# Altium schematic sheet Sheet3_Power.SchDoc
size A; SheetNumber: 3; SheetTotal: 6
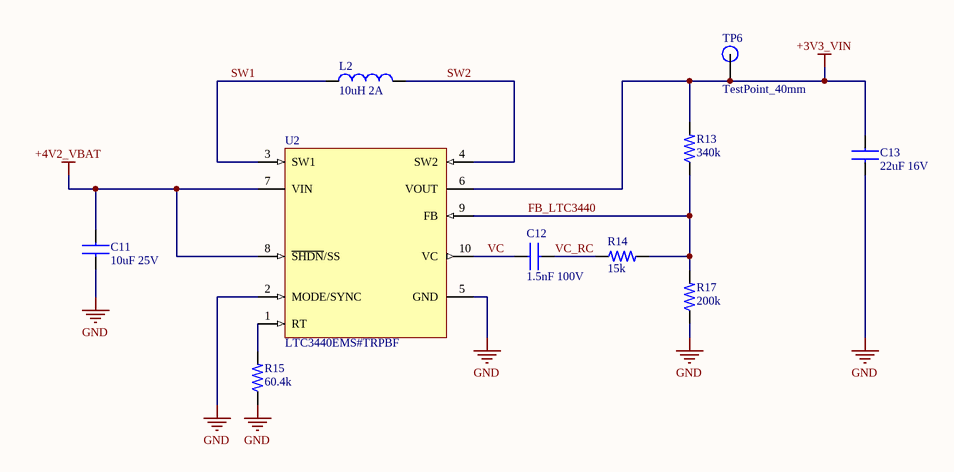
[diagram p0: Sheet3_Power.SchDoc]

## Parts
C11  10uF 25V  [CAP_0805_1_4MM]
C12  1.5nF 100V  [CAP_0805_1_4MM]
C13  22uF 16V  [CAP_0805_1_4MM]
L2  10uH 2A  [IND_4x4MM]
R13  340k  [RES_0603_1608X06]
R14  15k  [RES_0603_1608X06]
R15  60.4k  [RES_0603_1608X06]
R17  200k  [RES_0603_1608X06]
TP6  TestPoint_40mm  [TP_40MM]
U2  LTC3440EMS#TRPBF  [10-MSOP_3x3]

## Nets
+3V3_VIN: C13.1 R13.2 TP6.1 U2.6(VOUT)
+4V2_VBAT: C11.1 U2.7(VIN) U2.8(~{SHDN}/SS)
GND: C11.2 C13.2 R15.1 R17.1 U2.2(MODE/SYNC) U2.5(GND)
FB_LTC3440: R13.1 R14.2 R17.2 U2.9(FB)
SW1: L2.1 U2.3(SW1)
SW2: L2.2 U2.4(SW2)
VC: C12.2 U2.10(VC)
VC_RC: C12.1 R14.1
NetR15_2: R15.2 U2.1(RT)

## Library data of the parts
C11 = GRM21BR61E106KA73K: CAP CER 10UF 25V X5R 0805; Manufacturer: Murata; Tolerance: 10%; Supplier 1: Digi-Key; Manufacturer Part Number: GRM21BR61E106KA73K; RoHS: Yes; Category: Ceramic Capacitors; Stock 1: 101639; Pricing 1: 1=0.23000, 10=0.15700, 50=0.09400, 100=0.07940, 500=0.05434, 1000=0.04807, 2500=0.04598, 5000=0.04180 (USD); Mount: Surface Mount; Case/Package: 0805; Weight: 0.000335oz; Min Operating Temperature: -55°C; Max Operating Temperature: 85°C; Packaging: Tape and Reel; Capacitance: 10uF; Voltage Rating: 25V; Package Quantity: 10000; Dielectric: X5R; Voltage Rating (DC): 25V; Length: 0.079inch; Width: 0.049inch; Thickness: 0.055inch; RoHS Compliant: Yes; ComponentLink1URL: http://www.mouser.com/ds/2/281/c02e-2905.pdf?src-supplier=Mouser; ComponentLink1Description: http://www.mouser.com/ds/2/281/c02e-2905.pdf?src-supplier=Mouser; ComponentLink2URL: http://search.murata.co.jp/Ceramy/image/img/A01X/G101/ENG/GRM21BR61E106KA73-01.pdf?src-supplier=Digi-Key; ComponentLink2Description: http://search.murata.co.jp/Ceramy/image/img/A01X/G101/ENG/GRM21BR61E106KA73-01.pdf?src-supplier=Digi-Key; ComponentLink3URL: https://search.murata.co.jp/Ceramy/image/img/A01X/G101/ENG/GRM21BR61E106KA73-01.pdf?src-supplier=Digi-Key; ComponentLink3Description: https://search.murata.co.jp/Ceramy/image/img/A01X/G101/ENG/GRM21BR61E106KA73-01.pdf?src-supplier=Digi-Key
C12 = C0805C152J1RECAUTO: Cap Cer 0805 1.5NF 100V X7R 5%
C13 = CL21A226MOCLRNC: CAP CER 22UF 16V X5R 0805; Manufacturer: Samsung; Tolerance: 20%; Supplier 1: Digi-Key; Manufacturer Part Number: CL21A226MOCLRNC; RoHS: Yes; Category: Ceramic Capacitors; Stock 1: 182418; Pricing 1: 1=0.35000, 10=0.23900, 50=0.15920, 100=0.13540, 500=0.09554, 1000=0.08360 (USD); Mount: Surface Mount; Case/Package: 0805; Case Code (Metric): 2012; Case Code (Imperial): 0805; Min Operating Temperature: -55°C; Max Operating Temperature: 85°C; Packaging: Tape and Reel; Capacitance: 22uF; Voltage Rating: 16V; Length: 0.079inch; Width: 0.049inch; Thickness: 0.037inch; ComponentLink1URL: http://www.samsungsem.com/kr/support/product-search/mlcc/CL21A226MOCLRNC.jsp?src-supplier=Digi-Key; ComponentLink1Description: http://www.samsungsem.com/kr/support/product-search/mlcc/CL21A226MOCLRNC.jsp?src-supplier=Digi-Key
L2 = TYA4020100M-10: FIXED IND 10UH 2A 220 MOHM SMD; Manufacturer: Laird; Supplier 1: Digi-Key; Manufacturer Part Number: TYA4020100M-10; RoHS: No
R13 = CRCW0603340KFKEA: VISHAY - CRCW0603340KFKEA - SMD Chip Resistor, 0603 [1608 Metric], 340 kohm, CRCW e3 Series, 75 V, Thick Film, 100 mW; Resistance: 340kR; Tolerance: 1%; Temperature Coefficient: 100ppm/°C; Max Power Dissipation: 100mW; Voltage Rating: 75V; Supplier 1: Digi-Key; Manufacturer: Vishay; Manufacturer Part Number: CRCW0603340KFKEA; RoHS: Yes; Category: Chip SMD Resistors; Stock 1: 9256; Pricing 1: 1=0.10000, 10=0.03400, 100=0.01390, 1000=0.00624, 2500=0.00542 (USD); Case/Package: 0603; Number of Pins: 2; Weight: 7.1E-05oz; Case Code (Metric): 1608; Case Code (Imperial): 0603; Contact Plating: Tin; Size Code: 0603; Min Operating Temperature: -55°C; Max Operating Temperature: 155°C; Packaging: Tape and Reel; Package Quantity: 10; Resistor Type: Thick Film; Number of Terminations: 2; Features: Automotive AEC-Q200; Series: CRCW; Power Rating: 100mW; Termination: SMD/SMT; Voltage Rating (DC): 75V; Resistance Tolerance: 1%; Construction: Rectangular; Length: 1.55mm; Width: 0.033inch; Height: 0.02inch; Depth: 0.85mm; Radiation Hardening: No; Lead Free: Lead Free; RoHS Compliant: Yes; REACH SVHC: Unknown; Military Standard: Not; ComponentLink1URL: https://datasheet.ciiva.com/2466/dcrcwe3-2466626.pdf?src-supplier=Digi-Key; ComponentLink1Description: https://datasheet.ciiva.com/2466/dcrcwe3-2466626.pdf?src-supplier=Digi-Key; ComponentLink2URL: https://datasheet.ciiva.com/2466/dcrcwe3-2466627.pdf?src-supplier=Digi-Key; ComponentLink2Description: https://datasheet.ciiva.com/2466/dcrcwe3-2466627.pdf?src-supplier=Digi-Key; ComponentLink3URL: https://datasheet.ciiva.com/2466/dcrcwe3-2466628.pdf?src-supplier=Digi-Key; ComponentLink3Description: https://datasheet.ciiva.com/2466/dcrcwe3-2466628.pdf?src-supplier=Digi-Key; ComponentLink4URL: https://datasheet.ciiva.com/3257/dcrcwe3-3257477.pdf?src-supplier=Avnet; ComponentLink4Description: https://datasheet.ciiva.com/3257/dcrcwe3-3257477.pdf?src-supplier=Avnet; ComponentLink5URL: https://datasheet.ciiva.com/7674/1697337-7674078.pdf?src-supplier=Element14; ComponentLink5Description: https://datasheet.ciiva.com/7674/1697337-7674078.pdf?src-supplier=Element14; ComponentLink6URL: https://datasheet.ciiva.com/5548/dcrcwe3-109170-5548476.pdf?src-supplier=Mouser; ComponentLink6Description: https://datasheet.ciiva.com/5548/dcrcwe3-109170-5548476.pdf?src-supplier=Mouser; ComponentLink7URL: https://datasheet.ciiva.com/7674/1697337-7674079.pdf?src-supplier=Element14; ComponentLink7Description: https://datasheet.ciiva.com/7674/1697337-7674079.pdf?src-supplier=Element14
R14 = RMCF0603JG15K0: SWITCH SLIDE DIP SPST 50MA 24V; Manufacturer: Stackpole Electronics; Resistance: 15kR; Tolerance: 5%; Max Power Dissipation: 100mW; Temperature Coefficient: 200ppm/°C; Body Material: Plastic; Number of Positions: 2; Electrical Life: 10000Cycles; Actuator Type: Slide (Standard); Pitch: 0.1inch; Washable: No; Supplier 1: Digi-Key; Manufacturer Part Number: RMCF0603JG15K0; RoHS: Yes; Category: Chip SMD Resistors; Stock 1: 51631; Pricing 1: 1=0.10000, 10=0.01400, 100=0.00580, 1000=0.00262, 2500=0.00228, 5000=0.00188 (USD); Mount: Surface Mount; Case/Package: 0603; Case Code (Metric): 1608; Case Code (Imperial): 0603; Contact Plating: Tin,Matte; Min Operating Temperature: -55°C; Max Operating Temperature: 155°C; Package Quantity: 1; Packaging: Tape and Reel; Resistor Type: Thick Film; Number of Terminations: 2; Features: Automotive AEC-Q200; Series: RMCF; Length: 0.061inch; Width: 0.031inch; Height: 0.022inch; Radiation Hardening: No; RoHS Compliant: Yes; ComponentLink1URL: https://www.seielect.com/catalog/SEI-Packaging.pdf?src-supplier=Digi-Key; ComponentLink1Description: https://www.seielect.com/catalog/SEI-Packaging.pdf?src-supplier=Digi-Key; ComponentLink2URL: https://www.seielect.com/catalog/SEI-RMCF_RMCP.pdf?src-supplier=Avnet; ComponentLink2Description: https://www.seielect.com/catalog/SEI-RMCF_RMCP.pdf?src-supplier=Avnet; Supplier 2: Digi-Key; Stock 2: 7650; Pricing 2: 1=0.74000, 10=0.71500, 25=0.68760, 100=0.59680, 250=0.54452, 500=0.50600, 1000=0.45375, 2500=0.42625, 5000=0.39600 (USD); Contact Material: Copper Alloy; Max Current Rating: 50mA; Throw Configuration: SPST; Current Rating: 50mA; Voltage Rating (DC): 24V; Termination: PC Pin; Orientation: Straight; Terminal Pitch: 2.54mm; Depth: 9.78mm; Lead Free: Lead Free; ComponentLink3URL: https://datasheet.ciiva.com/16370/206-208-16370206.pdf?src-supplier=Future+Electronics; ComponentLink3Description: https://datasheet.ciiva.com/16370/206-208-16370206.pdf?src-supplier=Future+Electronics; ComponentLink4URL: https://datasheet.ciiva.com/2863/206-208-2863487.pdf?src-supplier=Digi-Key; ComponentLink4Description: https://datasheet.ciiva.com/2863/206-208-2863487.pdf?src-supplier=Digi-Key
R15 = RMCF0603FT60K4: Res Thick Film 0603 60.4K Ohm 1% 1/10W 100ppm/C Molded SMD SMD Paper T/R; Manufacturer: Stackpole Electronics; Resistance: 60.4kR; Max Power Dissipation: 100mW; Temperature Coefficient: 100ppm/°C; Supplier 1: Digi-Key; Manufacturer Part Number: RMCF0603FT60K4; RoHS: Yes; Category: Chip SMD Resistors; Stock 1: 81528; Pricing 1: 1=0.10000, 10=0.01600, 100=0.00650, 1000=0.00292, 2500=0.00253 (USD); Mount: Surface Mount; Case/Package: 0603; Case Code (Metric): 1608; Case Code (Imperial): 0603; Contact Plating: Tin,Matte; Min Operating Temperature: -55°C; Max Operating Temperature: 155°C; Packaging: Tape and Reel; Tolerance: 1%; Resistor Type: Thick Film; Number of Terminations: 2; Features: Automotive AEC-Q200; Series: RMCF; Construction: Rectangular; Length: 1.55mm; Width: 0.031inch; Height: 0.022inch; Depth: 0.8mm; Radiation Hardening: No; Military Standard: Not; RoHS Compliant: Yes; ComponentLink1URL: http://components.arrow.com/part/dataview/47797003S7054871N1174?src-supplier=Arrow+Electronics; ComponentLink1Description: http://components.arrow.com/part/dataview/47797003S7054871N1174?src-supplier=Arrow+Electronics; ComponentLink2URL: https://www.verical.com/server-webapp/html/getDatasheet?partID=493745&src-supplier=Verical; ComponentLink2Description: https://www.verical.com/server-webapp/html/getDatasheet?partID=493745&src-supplier=Verical; ComponentLink3URL: https://www.seielect.com/catalog/SEI-RMCF_RMCP.pdf?src-supplier=Avnet; ComponentLink3Description: https://www.seielect.com/catalog/SEI-RMCF_RMCP.pdf?src-supplier=Avnet; ComponentLink4URL: https://www.seielect.com/Catalog/SEI-RMCF_RMCP.pdf?src-supplier=Digi-Key; ComponentLink4Description: https://www.seielect.com/Catalog/SEI-RMCF_RMCP.pdf?src-supplier=Digi-Key; ComponentLink5URL: https://www.seielect.com/catalog/SEI-Packaging.pdf?src-supplier=Digi-Key; ComponentLink5Description: https://www.seielect.com/catalog/SEI-Packaging.pdf?src-supplier=Digi-Key; ComponentLink6URL: https://www.seielect.com/catalog/SEI-RMCF_RMCP.pdf?src-supplier=Avnet+Asia; ComponentLink6Description: https://www.seielect.com/catalog/SEI-RMCF_RMCP.pdf?src-supplier=Avnet+Asia
R17 = CRCW0603200KFKEA: VISHAY - CRCW0603200KFKEA - SMD Chip Resistor, 0603 [1608 Metric], 200 kohm, CRCW e3 Series, 75 V, Thick Film, 100 mW; Tolerance: 1%; Resistance: 200kR; Temperature Coefficient: 100ppm/°C; Power Rating: 100mW; Voltage Rating: 75V; Supplier 1: Avnet; Manufacturer: Vishay; Manufacturer Part Number: CRCW0603200KFKEA; RoHS: Yes; Category: Chip SMD Resistors; Stock 1: 660000; Pricing 1: 5000=0.00192, 10000=0.00189, 20000=0.00184, 30000=0.00180, 40000=0.00173, 50000=0.00169, 500000=0.00165 (USD); Mount: Surface Mount; Case/Package: 0603; Contact Plating: Tin; Weight: 7.1E-05oz; Case Code (Metric): 1608; Case Code (Imperial): 0603; Min Operating Temperature: -55°C; Max Operating Temperature: 155°C; Resistor Type: Thick Film; Packaging: Tape and Reel; Package Quantity: 10; Number of Terminations: 2; Termination: SMD/SMT; Max Power Dissipation: 100mW; Features: Automotive AEC-Q200; Series: CRCW; Construction: Rectangular; Voltage Rating (DC): 75V; Working Voltage: 75V; Technology: THICK FILM; Resistance Tolerance: 1%; Length: 1.55mm; Width: 0.033inch; Height: 0.45mm; Depth: 0.85mm; Radiation Hardening: No; Lead Free: Lead Free; RoHS Compliant: Yes; Military Standard: Not; REACH SVHC: Unknown; ComponentLink1URL: https://datasheet.ciiva.com/11808/0900766b80d98afc-11808389.pdf?src-supplier=RSComponents; ComponentLink1Description: https://datasheet.ciiva.com/11808/0900766b80d98afc-11808389.pdf?src-supplier=RSComponents; ComponentLink2URL: https://datasheet.ciiva.com/2465/dcrcwe3-2465731.pdf?src-supplier=Digi-Key; ComponentLink2Description: https://datasheet.ciiva.com/2465/dcrcwe3-2465731.pdf?src-supplier=Digi-Key; ComponentLink3URL: https://datasheet.ciiva.com/16199/dcrcwe3-16199205.pdf?src-supplier=Future+Electronics; ComponentLink3Description: https://datasheet.ciiva.com/16199/dcrcwe3-16199205.pdf?src-supplier=Future+Electronics; ComponentLink4URL: https://datasheet.ciiva.com/7714/1697337-7714246.pdf?src-supplier=Element14; ComponentLink4Description: https://datasheet.ciiva.com/7714/1697337-7714246.pdf?src-supplier=Element14; ComponentLink5URL: https://datasheet.ciiva.com/3257/dcrcwe3-3257230.pdf?src-supplier=Avnet; ComponentLink5Description: https://datasheet.ciiva.com/3257/dcrcwe3-3257230.pdf?src-supplier=Avnet; ComponentLink6URL: https://datasheet.ciiva.com/3257/dcrcwe3-3257231.pdf?src-supplier=Avnet; ComponentLink6Description: https://datasheet.ciiva.com/3257/dcrcwe3-3257231.pdf?src-supplier=Avnet; ComponentLink7URL: https://datasheet.ciiva.com/2465/dcrcwe3-2465729.pdf?src-supplier=Digi-Key; ComponentLink7Description: https://datasheet.ciiva.com/2465/dcrcwe3-2465729.pdf?src-supplier=Digi-Key; ComponentLink8URL: https://datasheet.ciiva.com/2465/dcrcwe3-2465730.pdf?src-supplier=Digi-Key; ComponentLink8Description: https://datasheet.ciiva.com/2465/dcrcwe3-2465730.pdf?src-supplier=Digi-Key; ComponentLink9URL: https://datasheet.ciiva.com/5546/dcrcwe3-109170-5546041.pdf?src-supplier=Mouser; ComponentLink9Description: https://datasheet.ciiva.com/5546/dcrcwe3-109170-5546041.pdf?src-supplier=Mouser; ComponentLink10URL: https://datasheet.ciiva.com/16893/dcrcwe3-16893833.pdf?src-supplier=Avnet+Europe; ComponentLink10Description: https://datasheet.ciiva.com/16893/dcrcwe3-16893833.pdf?src-supplier=Avnet+Europe
U2 = LTC3440EMS#TRPBF: IC REG BUCK BST ADJ 0.6A 10MSOP; Manufacturer: Analog Devices / Linear Technology; Output Voltage: 5.5V; Output Current: 600mA; Efficiency: 96%; Min Input Voltage: 2.5V; Number of Outputs: 1; Switching Frequency: 2MHz; Synchronous Rectifier: Yes; Output Type: Adjustable; Supplier 1: Digi-Key; Manufacturer Part Number: LTC3440EMS#TRPBF; RoHS: Yes; Category: Voltage Regulators - Switching; Stock 1: 8435; Pricing 1: 1=6.71000, 10=6.06200, 25=5.78000, 100=4.79330, 250=4.37040, 500=4.08842, 1000=3.72400 (USD); Case/Package: MSOP; Number of Pins: 10; Min Operating Temperature: -40°C; Max Operating Temperature: 85°C; Package Quantity: 2500; Packaging: Tape and Reel; Series: -; Lead Free: Lead Free; RoHS Compliant: Yes; ComponentLink1URL: https://datasheet.ciiva.com/26899/ltc3440ems-trpbf-26899120.pdf?src-supplier=IIIC; ComponentLink1Description: https://datasheet.ciiva.com/26899/ltc3440ems-trpbf-26899120.pdf?src-supplier=IIIC; ComponentLink2URL: https://datasheet.ciiva.com/2031/3314-2031816.pdf?src-supplier=Digi-Key; ComponentLink2Description: https://datasheet.ciiva.com/2031/3314-2031816.pdf?src-supplier=Digi-Key